# Altium schematic sheet PCB.schdoc
size 420 x 297 mm; Color: #000000; Width: 1655; Height: 1170; Symbol: Drawing-Symbol_A4; Company: 嘉立创EDA; Version: V1.0; Page Size: A4; @Project Name: Watcher; @Update Date: 2026-01-27; @Create Date: 2026-01-27; Device: Drawing-Symbol_A4; @Board Name: Board1; @Page Name: P1; @Create Time: 14:43:38; @Page Count: 1; @Page No: 1; @Schematic Name: Schematic1; @Update Time: 14:43:38; @Assembly Variant: Basic; Border: 1; Title Block Position: 3; Size: A4; Region Start: 1; X Region Count: 6; Y Region Count: 4; Blade Width: 10; Title Block: 1
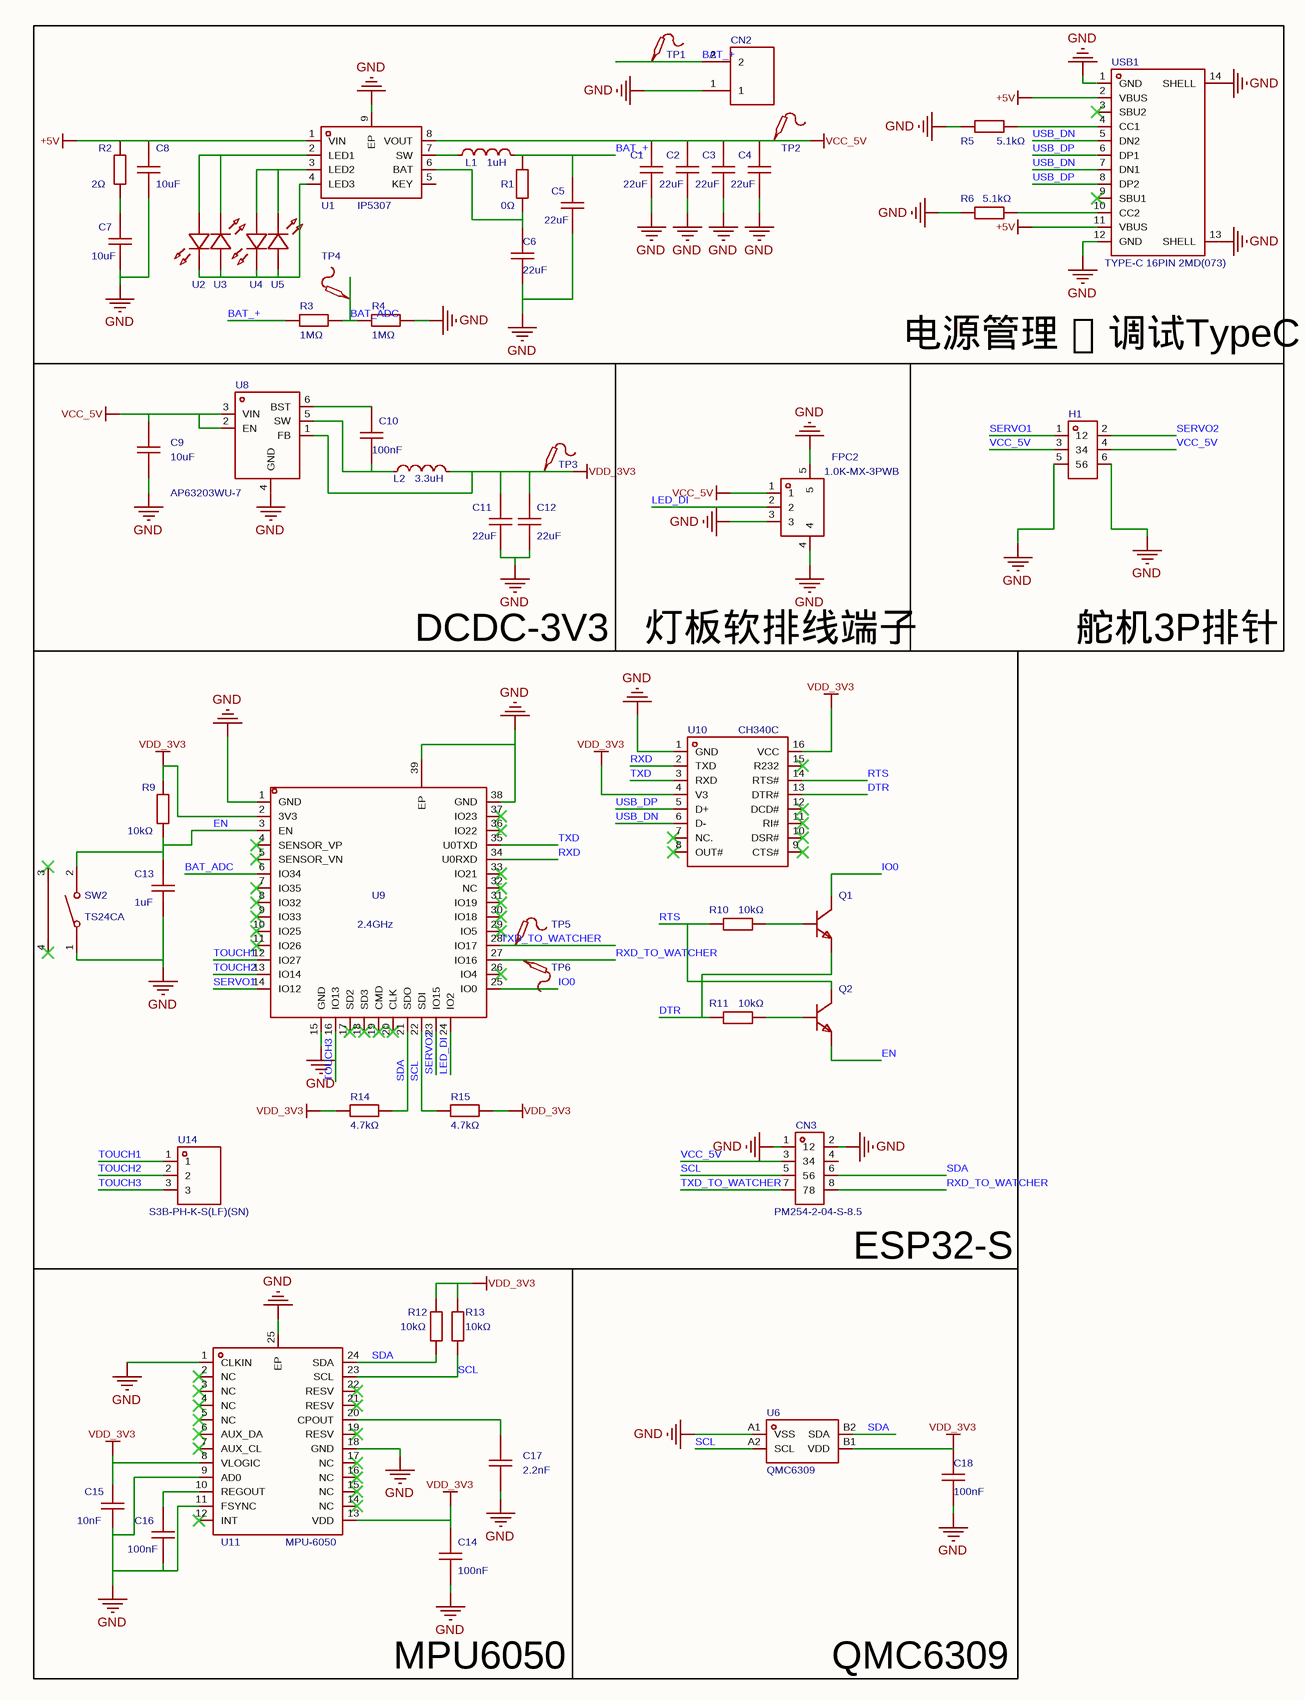
[diagram p0: PCB.schdoc]

## Parts
C1  22uF  [C0603_2]
C2  22uF  [C0603_2]
C3  22uF  [C0603_2]
C4  22uF  [C0603_2]
C5  22uF  [C0603_2]
C6  22uF  [C0603_2]
C7  10uF  [C0603_2]
C8  10uF  [C0603_2]
C9  10uF  [C0603_2]
C10  100nF  [C0603_2]
C11  22uF  [C0603_2]
C12  22uF  [C0603_2]
C13  1uF  [C0603_2]
C14  100nF  [C0603_2]
C15  10nF  [C0603_2]
C16  100nF  [C0603_2]
C17  2.2nF  [C0603_2]
C18  100nF  [C0402]
CN2  B2B-PH-K-S(LF)(SN)  [CONN-TH_B2B-PH-K-S]  (value not drawn)
CN3  PM254-2-04-S-8.5  [HDR-SMD_8P-P2.54-V-F-R2-C4-S7.1]
FPC2  1.0K-MX-3PWB  [FPC-SMD_3P-P1.00_HDGC_1.0K-MX-3PWB]
H1  PZ254V-12-6P  [HDR-TH_6P-P2.54-V-M-R2-C3-S2.54]  (value not drawn)
L1  1uH  [IND-SMD_L4.4-W4.2]
L2  3.3uH  [IND-SMD_L4.4-W4.2-A]
Q1  MMS8050-H-TP  [SOT-23-3_L2.9-W1.3-P1.90-LS2.4-BR_1]  (value not drawn)
Q2  MMS8050-H-TP  [SOT-23-3_L2.9-W1.3-P1.90-LS2.4-BR_1]  (value not drawn)
R1  0Ω  [R0603_3]
R2  2Ω  [R0603_3]
R3  1MΩ  [R0603_3]
R4  1MΩ  [R0603_3]
R5  5.1kΩ  [R0603_3]
R6  5.1kΩ  [R0603_3]
R9  10kΩ  [R0603_3]
R10  10kΩ  [R0603_3]
R11  10kΩ  [R0603_3]
R12  10kΩ  [R0603_3]
R13  10kΩ  [R0603_3]
R14  4.7kΩ  [R0603_3]
R15  4.7kΩ  [R0603_3]
SW2  TS24CA  [SW-SMD_2P-TS24CA]
TP1  (no value)  [Test-Point-0.5mm]
TP2  (no value)  [Test-Point-0.5mm]
TP3  (no value)  [Test-Point-0.5mm]
TP4  (no value)  [Test-Point-0.5mm]
TP5  (no value)  [Test-Point-0.5mm]
TP6  (no value)  [Test-Point-0.5mm]
U1  IP5307  [ESOP-8_L4.9-W3.9-P1.27-LS6.0-BL-EP]
U2  XL-1608PGC-06  [LED0603-RD_GREEN]  (value not drawn)
U3  XL-1608PGC-06  [LED0603-RD_GREEN]  (value not drawn)
U4  XL-1608PGC-06  [LED0603-RD_GREEN]  (value not drawn)
U5  XL-1608PGC-06  [LED0603-RD_GREEN]  (value not drawn)
U6  QMC6309  [X1-WLB0808-4_L0.8-W0.8-P0.40-TL]
U8  AP63203WU-7  [TSOT-26_L2.9-W1.6-P0.95-LS2.8-BL_1]
U9  2.4GHz  [WIRELM-SMD_ESP32-S_1]
U10  CH340C  [SOP-16_L10.0-W3.9-P1.27-LS6.0-BL_1]
U11  MPU-6050  [QFN-24_L4.0-W4.0-P0.50-BL-EP2.7_1]
U14  S3B-PH-K-S(LF)(SN)  [CONN-TH_3P-P2.00_S3B-PH-K-S-LF-SN]
USB1  TYPE-C 16PIN 2MD(073)  [USB-C-SMD_TYPE-C-6PIN-2MD-073]

## Blocks framed on the sheet
电源管理  调试TypeC: C1-C8 CN2 L1 R1-R6 TP1 TP2 TP4 U1-U5 USB1
DCDC-3V3: C9-C12 L2 TP3 U8
舵机3P排针: H1
MPU6050: C14-C17 R12 R13 U11

## Nets
+5V: C8.2 R2.2 U1.1(VIN) USB1.2(VBUS) USB1.11(VBUS)
GND: C1.1 C2.1 C3.1 C4.1 C5.1 C6.1 C7.1 C8.1 C9.1 C11.1 C12.1 C13.1 C14.1 C15.1 C16.1 C17.1 C18.1 CN2.1 CN3.1 CN3.2 FPC2.3 FPC2.4 FPC2.5 H1.5 H1.6 R4.1 R5.1 R6.1 SW2.1 U1.9(EP) U6.A1(VSS) U8.4(GND) U9.1(GND) U9.15(GND) U9.38(GND) U9.39(EP) U10.1(GND) U11.1(CLKIN) U11.9(AD0) U11.11(FSYNC) U11.18(GND) U11.25(EP) USB1.1(GND) USB1.12(GND) USB1.13(SHELL) USB1.14(SHELL)
VCC_5V: C1.2 C2.2 C3.2 C4.2 C9.2 CN3.3 FPC2.1 H1.3 H1.4 TP2.1 U1.8(VOUT) U8.2(EN) U8.3(VIN)
VDD_3V3: C11.2 C12.2 C14.2 C15.2 C18.2 L2.2 R9.2 R12.2 R13.2 R14.1 R15.2 TP3.1 U6.B1(VDD) U8.1(FB) U9.2(3V3) U10.4(V3) U10.16(VCC) U11.8(VLOGIC) U11.13(VDD)
BAT_+: C5.2 CN2.2 L1.2 R1.2 R3.2 TP1.1
BAT_ADC: R3.1 R4.2 TP4.1 U9.6(IO34)
DTR: Q1.2(E) R11.1 U10.13(DTR#)
EN: C13.2 Q2.2(E) R9.1 SW2.2 U9.3(EN)
IO0: Q1.3(C) U9.25(IO0)
LED_DI: FPC2.2 U9.24(IO2)
RTS: Q2.3(C) R10.1 U10.14(RTS#)
RXD: U9.34(U0RXD) U10.2(TXD)
RXD_TO_WATCHER: CN3.8 TP6.1 U9.27(IO16)
SCL: CN3.5 R13.1 R15.1 U6.A2(SCL) U9.22(SDI) U11.23(SCL)
SDA: CN3.6 R12.1 R14.2 U6.B2(SDA) U9.21(SDO) U11.24(SDA)
SERVO1: H1.1 U9.14(IO12)
SERVO2: H1.2 U9.23(IO15)
TOUCH1: U9.12(IO27) U14.1
TOUCH2: U9.13(IO14) U14.2
TOUCH3: U9.16(IO13) U14.3
TXD: U9.35(U0TXD) U10.3(RXD)
TXD_TO_WATCHER: CN3.7 TP5.1 U9.28(IO17)
USB_DN: U10.6(D-) USB1.5(DN2) USB1.7(DN1)
USB_DP: U10.5(D+) USB1.6(DP1) USB1.8(DP2)
NetC6_2: C6.2 R1.1 U1.6(BAT)
NetC7_2: C7.2 R2.1
NetC10_1: C10.1 L2.1 U8.5(SW)
NetC10_2: C10.2 U8.6(BST)
NetC16_2: C16.2 U11.10(REGOUT)
NetC17_2: C17.2 U11.20(CPOUT)
NetL1_1: L1.1 U1.7(SW)
NetQ1_1: Q1.1(B) R10.2
NetQ2_1: Q2.1(B) R11.2
NetR5_2: R5.2 USB1.4(CC1)
NetR6_2: R6.2 USB1.10(CC2)
NetU1_2: U1.2(LED1) U2.2(A) U3.1(K)
NetU1_3: U1.3(LED2) U4.2(A) U5.1(K)
NetU1_4: U1.4(LED3) U2.1(K) U3.2(A) U4.1(K) U5.2(A)

Not connected (* = marked no-connect by the designer): CN3 4; SW2 3* 4*; U1 5(KEY); U9 4(SENSOR_VP)* 5(SENSOR_VN)* 7(IO35)* 8(IO32)* 9(IO33)* 10(IO25)* 11(IO26)* 17(SD2)* 18(SD3)* 19(CMD)* 20(CLK)* 26(IO4)* 29(IO5)* 30(IO18)* 31(IO19)* 32(NC)* 33(IO21)* 36(IO22)* 37(IO23)*; U10 7(NC.)* 8(OUT#)* 9(CTS#)* 10(DSR#)* 11(RI#)* 12(DCD#)* 15(R232)*; U11 2(NC)* 3(NC)* 4(NC)* 5(NC)* 6(AUX_DA)* 7(AUX_CL)* 12(INT)* 14(NC)* 15(NC)* 16(NC)* 17(NC)* 19(RESV)* 21(RESV)* 22(RESV)*; USB1 3(SBU2)* 9(SBU1)*

## Notes on the sheet
- 灯板软排线端子
- (near CN3) ESP32-S
- QMC6309
- 1
- 2
- 3
- 4
- 5
- 6
- A
- B
- C
- 创建日期
- 2026-01-27
- D
- 原理图
- 板子
- Schematic1
- Board1
- 更新日期
- 图页
- P1
- 绘制
- 审阅
- Watcher
- 版本
- V1.0
- 尺寸
- A4
- 页    1    共    1
- 嘉立创EDA

## Library data of the parts
C1-C6 C11 C12 = CGA0603X5R226M100JT: 容值:22uF;精度:±20%;额定电压:10V;温度系数:X5R;; Manufacturer: HRE(芯声); 3D Model: ac125912035d415993ca9572d50418b1; 3D Model Transform: 62.992,31.496,0,0,0,0,0,0,0; Tolerance: ±20%; Voltage Rating: 10V; Temperature Coefficient: X5R; AddInBom: yes; ModelName: C0603_L1.6-W0.8-H0.8; Symbol: CGA0603X5R226M100JT; Device: CGA0603X5R226M100JT; LCSC Part Name: 22uF ±20% 10V; Supplier Part: C6119863; Manufacturer Part: CGA0603X5R226M100JT; Supplier Footprint: 0603; JLCPCB Part Class: 扩展库; Datasheet: https://item.szlcsc.com/datasheet/CGA0603X5R226M100JT/7062569.html; Supplier: LCSC; Value: 22uF; ConvertToPcb: yes; FootprintName: C0603_2
C7-C9 = CGA0603X5R106K100JT: 容值:10uF;精度:±10%;额定电压:10V;温度系数:X5R;; Manufacturer: HRE(芯声); 3D Model: ac125912035d415993ca9572d50418b1; 3D Model Transform: 62.992,31.496,0,0,0,0,0,0,0; Tolerance: ±10%; Voltage Rating: 10V; Temperature Coefficient: X5R; AddInBom: yes; ModelName: C0603_L1.6-W0.8-H0.8; Symbol: CGA0603X5R106K100JT; Device: CGA0603X5R106K100JT; LCSC Part Name: 10uF ±10% 10V; Supplier Part: C6119842; Manufacturer Part: CGA0603X5R106K100JT; Supplier Footprint: 0603; JLCPCB Part Class: 扩展库; Datasheet: https://item.szlcsc.com/datasheet/CGA0603X5R106K100JT/7062548.html; Supplier: LCSC; Value: 10uF; ConvertToPcb: yes; FootprintName: C0603_2
C10 C14 C16 = CC0603KRX7R9BB104: 容值:100nF;精度:±10%;额定电压:50V;温度系数:X7R;; Manufacturer: YAGEO(国巨); Symbol: CC0603KRX7R9BB104_1; 3D Model: ac125912035d415993ca9572d50418b1; 3D Model Transform: 62.992,31.496,0,0,0,0,0,0,0; Tolerance: ±10%; Voltage Rating: 50V; Temperature Coefficient: X7R; AddInBom: yes; ModelName: C0603_L1.6-W0.8-H0.8; Device: CC0603KRX7R9BB104; LCSC Part Name: 100nF ±10% 50V; Supplier Part: C14663; Manufacturer Part: CC0603KRX7R9BB104; Supplier Footprint: 0603; JLCPCB Part Class: 基础库; Datasheet: https://item.szlcsc.com/datasheet/CC0603KRX7R9BB104/15331.html; Supplier: LCSC; Value: 100nF; Voltage Rated: 50V; ConvertToPcb: yes; FootprintName: C0603_2
C13 = CGA0603X5R105K500JT: 容值:1uF;精度:±10%;额定电压:50V;温度系数:X5R;; Manufacturer: HRE(芯声); 3D Model: ac125912035d415993ca9572d50418b1; 3D Model Transform: 62.992,31.496,0,0,0,0,0,0,0; Tolerance: ±10%; Voltage Rating: 50V; Temperature Coefficient: X5R; AddInBom: yes; ModelName: C0603_L1.6-W0.8-H0.8; Symbol: CGA0603X5R105K500JT; Device: CGA0603X5R105K500JT; LCSC Part Name: 1uF ±10% 50V; Supplier Part: C6119852; Manufacturer Part: CGA0603X5R105K500JT; Supplier Footprint: 0603; JLCPCB Part Class: 扩展库; Datasheet: https://item.szlcsc.com/datasheet/CGA0603X5R105K500JT/7062558.html; Supplier: LCSC; Value: 1uF; ConvertToPcb: yes; FootprintName: C0603_2
C15 = CC0603KRX7R9BB103: 容值:10nF;精度:±10%;额定电压:50V;温度系数:X7R;; Manufacturer: YAGEO(国巨); 3D Model: ac125912035d415993ca9572d50418b1; 3D Model Transform: 62.992,31.496,0,0,0,0,0,0,0; Tolerance: ±10%; Voltage Rating: 50V; Temperature Coefficient: X7R; AddInBom: yes; ModelName: C0603_L1.6-W0.8-H0.8; Symbol: CC0603KRX7R9BB103; Device: CC0603KRX7R9BB103; Supplier: LCSC; Manufacturer Part: CC0603KRX7R9BB103; Value: 10nF; Supplier Part: C100042; JLCPCB Part Class: 扩展库; LCSC Part Name: 10nF ±10% 50V; Supplier Footprint: 0603; Datasheet: https://item.szlcsc.com/datasheet/CC0603KRX7R9BB103/101256.html; Voltage Rated: 50V; ConvertToPcb: yes; FootprintName: C0603_2
C17 = FCC0603B222K500CT: 容值:2.2nF;精度:±10%;额定电压:50V;温度系数:X7R;; Manufacturer: FOJAN(富捷); 3D Model: ac125912035d415993ca9572d50418b1; 3D Model Transform: 62.992,31.496,0,0,0,0,0,0,0; Tolerance: ±10%; Voltage Rating: 50V; Temperature Coefficient: X7R; AddInBom: yes; ModelName: C0603_L1.6-W0.8-H0.8; Symbol: FCC0603B222K500CT; Device: FCC0603B222K500CT; LCSC Part Name: 2.2nF ±10% 50V; Supplier Part: C5137562; Manufacturer Part: FCC0603B222K500CT; Supplier Footprint: 0603; JLCPCB Part Class: Extended Part; Datasheet: https://item.szlcsc.com/datasheet/FCC0603B222K500CT/5747014.html; Supplier: LCSC; Value: 2.2nF; ConvertToPcb: yes; FootprintName: C0603_2
C18 = CL05B104KO5NNNC: 容值:100nF;精度:±10%;额定电压:16V;材质(温度系数):X7R;; Manufacturer: SAMSUNG(三星); Symbol: CapAcitance; 3D Model: 36a51122f27c49738f86b3bfa98863e0; 3D Model Transform: 39.37,19.685,0,0,0,0,0,0,0; Tolerance: ±10%; Voltage Rated: 16V; Temperature Coefficient: X7R; AddInBom: yes; ModelName: C0402_L1.0-W0.5-H0.5; Device: CL05B104KO5NNNC; LCSC Part Name: 100nF ±10% 16V; Supplier Part: C1525; Manufacturer Part: CL05B104KO5NNNC; Supplier Footprint: 0402; JLCPCB Part Class: 基础库; Datasheet: https://atta.szlcsc.com/upload/public/pdf/source/20160218/1457707763339.pdf; Supplier: LCSC; Value: 100nF; ConvertToPcb: yes; FootprintName: C0402
CN2 = B2B-PH-K-S(LF)(SN): 插针结构:1x2P;间距:2mm;安装方式:直插;参考系列:PH;总PIN数:2P;排数:1;每排PIN数:2;行距:-;额定电流:2A;触头材质:黄铜;触头镀层:锡;工作温度:-25℃~+85℃;; Manufacturer: JST; 3D Model: 007589569b7e4f74b269bfb3c7ed3cc50819f05c4eef4c71ace90d822a990e87; 3D Model Transform: 236.25937,181.102,0,180,0,0,0,23.622,-137.795; Pins Structure: 1x2P; Pitch: 2mm; Reference Series: PH; Number of PINs Per Row: 2; Current Rating: 2A; Voltage Rating: 100V; Plastic Material: PA66; Flame Retardant Rating: UL94V-0; Supplementary Features: 打K脚; Z-Height of the Board: 6mm; X-Length of Bottom Edge on Board (Spacing Line): 5.9mm; Y-Width of Bottom Edge on Board: 4.5mm; AddInBom: yes; ModelName: CONN-TH_PH2.00-LI-2P; Symbol: B2B-PH-K-S(LF)(SN); Device: B2B-PH-K-S(LF)(SN); LCSC Part Name: 1x2P 间距:2mm 直插 系列:PH; Supplier Part: C131337; Manufacturer Part: B2B-PH-K-S(LF)(SN); Supplier Footprint: 插件,P=2mm; JLCPCB Part Class: Extended Part; Datasheet: https://item.szlcsc.com/datasheet/B2B-PH-K-S(LF)(SN)/142630.html; Supplier: LCSC; Mounting Type: 直插; Number of Pins: 2P; Number of Rows: 1; Row Spacing: -; Contact Material: 黄铜; Contact Plating: 锡; Operating Temperature: -25℃~+85℃; Color: 白色; ConvertToPcb: yes; FootprintName: CONN-TH_B2B-PH-K-S
CN3 = PM254-2-04-S-8.5: 插孔结构:2x4P;间距:2.54mm;行距:2.54mm;圆孔/方孔:方孔;安装方式:立贴;排数:双排;总孔位数:8P;额定电流:3A;插孔方向:顶部;塑高:8.5mm;触头材质:铜合金;工作温度:-40℃~+105℃;; Manufacturer: HCTL(华灿天禄); AddInBom: yes; ModelId: cc5752a4f7204cf4ba4364301e8361650819f05c4eef4c71ace90d822a990e87; ModelTransform: 399.999,279.527,0,0,0,0,0,0,0; Holes Structure: 2x4P; Pitch: 2.54mm; Circular Hole / Square Hole: 方孔; Number of Positions: 8P; Current Rating: 3A; Holes Direction: 顶部; Symbol: PM254-2-04-S-8.5; Device: PM254-2-04-S-8.5; LCSC Part Name: 2x4P 间距:2.54mm 立贴; SupplierPart: C3975149; ManufacturerPart: PM254-2-04-S-8.5; Supplier Footprint: SMD,P=2.54mm; JLCPCB Part Class: Extended Part; Datasheet: https://item.szlcsc.com/datasheet/PM254-2-04-S-8.5/4543700.html; Supplier: LCSC; ConvertToPcb: yes; FootprintName: HDR-SMD_8P-P2.54-V-F-R2-C4-S7.1; ModelName: HDR-SMD_8P-P2.54-V-F-R2-C4-S7.1; Row Spacing: 2.54mm; Mounting Type: 立贴; Number of Rows: 双排; Insulation Height: 8.5mm; Contact Material: 铜合金; Operating Temperature: -40℃~+105℃
FPC2 = 1.0K-MX-3PWB: 锁定特性:抽屉式;触点类型:下接;触点数量:3P;间距:1mm;安装方式:卧贴;工作温度:-20℃~+85℃;; Manufacturer: HDGC(华德共创); AddInBom: yes; ModelId: 464b3a8418d4489894cbd3e194c6d1d50819f05c4eef4c71ace90d822a990e87; ModelTransform: 360.2355,206.693,0,0,0,0,0,-44.213,0; Locking Feature: 抽屉式; Number of Contacts: 3P; Pitch: 1mm; FFC, FCB Thickness: 0.3mm; Rated Voltage (Max): 50V; Current Rating (Max): 400mA; Symbol: 1.0K-MX-3PWB; Device: 1.0K-MX-3PWB; LCSC Part Name: 抽屉式 下接 P数:3P 间距:1mm; SupplierPart: C2915536; ManufacturerPart: 1.0K-MX-3PWB; Supplier Footprint: SMD,P=1mm,卧贴; JLCPCB Part Class: Extended Part; Datasheet: https://item.szlcsc.com/datasheet/1.0K-MX-3PWB/3209091.html; Supplier: LCSC; ConvertToPcb: yes; FootprintName: FPC-SMD_3P-P1.00_HDGC_1.0K-MX-3PWB; ModelName: FPC-SMD_3P-P1.00_HDGC_1.0K-MX-3PWB; Contact Type: 下接; Mounting Type: 卧贴; Height Above Board: 1mm; Contact Material: 磷青铜; Operating Temperature: -20℃~+85℃
H1 = PZ254V-12-6P: 插针结构:2x3P;间距:2.54mm;行距:2.54mm;圆针/方针:方针;安装类型:直插;排数:双排;总PIN位数:6P;额定电流:-;额定电压:-;配合针长度:6mm;塑高:2.5mm;端接针长度:3mm;触头材质:黄铜;触头镀层:-;工作温度范围:-40℃~+105℃;颜色:黑色;; Manufacturer: XFCN(兴飞); 3D Model: e22692306cbd4b5c8488f4142eed6b9c; 3D Model Transform: 300.3931,200,0,0,0,0,0,0,-118.11; Pin Structure: 2x3P; Pitch: 2.54mm; Circluar Pins/Square Pins: 方针; AddInBom: yes; Symbol: PZ254V-12-6P; Device: PZ254V-12-6P; LCSC Part Name: 间距:2.54mm 2x3P 直插 方针; Supplier Part: C492420; Manufacturer Part: PZ254V-12-6P; Supplier Footprint: 插件,P=2.54mm; JLCPCB Part Class: 扩展库; Datasheet: https://atta.szlcsc.com/upload/public/pdf/source/20200309/C492420_BAECB307B001054C09D200388220EAE6.pdf; Supplier: LCSC; Row Spacing: 2.54mm; Mounting Type: 直插; Number of Rows: 双排; Number of Pins: 6P; Current Rating (Max): -; Voltage Rating (Max): -; Length of Mating Pin: 6mm; Insulation Height: 2.5mm; Length of End Connection Pin: 3mm; Contact Material: 黄铜; Contact Plating: -; Operating Temperature Range: -40℃~+105℃; Color: 黑色; ConvertToPcb: yes; FootprintName: HDR-TH_6P-P2.54-V-M-R2-C3-S2.54; ModelName: HDR-TH_6P-P2.54-V-M-R2-C3-S2.54
L1 = FXL0420-1R0-M: 电感值:1uH;精度:±20%;额定电流:6A;饱和电流(Isat):7A;类型:一体成型电感;; Manufacturer: cjiang(长江微电); 3D Model: e9b3d3f4fa134185b54d517730715f16; 3D Model Transform: 173.228,165.354,0,0,0,0,0,0,0; Tolerance: ±20%; Rated Current: 6A; Saturation Current (Isat): 7A; DC Resistance (DCR): 27mΩ; Type: 一体成型电感; AddInBom: yes; ModelName: IND-SMD_L4.2-W4.4-H2.0; Symbol: FXL0420-1R0-M; Device: FXL0420-1R0-M; LCSC Part Name: 1uH ±20% 7A; Supplier Part: C167203; Manufacturer Part: FXL0420-1R0-M; Supplier Footprint: SMD,4.2x4.4mm; JLCPCB Part Class: 扩展库; Datasheet: https://atta.szlcsc.com/upload/public/pdf/source/20240426/3189EA8206330E2108542F9E34E540E7.pdf; Supplier: LCSC; Value: 1uH; ConvertToPcb: yes; FootprintName: IND-SMD_L4.4-W4.2
L2 = FXL0420-3R3-M: 电感值:3.3uH;精度:±20%;额定电流:3.3A;饱和电流(Isat):4A;类型:一体成型电感;; Manufacturer: cjiang(长江微电); 3D Model: ee48d226f3d94ad8b4065f1f448788f0; 3D Model Transform: 173.228,165.354,0,0,0,0,0,0,0; Tolerance: ±20%; Current Rating: 3.3A; Current - Saturation(Isat): 4A; DC Resistance(DCR): 87mΩ; Type: 一体成型电感; AddInBom: yes; ModelName: IND-SMD_L4.4-W4.2-H1.2_PSPMAA0412; Symbol: FXL0420-3R3-M; Device: FXL0420-3R3-M; LCSC Part Name: 3.3uH ±20% 4A; Supplier Part: C167207; Manufacturer Part: FXL0420-3R3-M; Supplier Footprint: SMD,4.4x4.2mm; JLCPCB Part Class: 扩展库; Datasheet: https://item.szlcsc.com/datasheet/FXL0420-3R3-M/178590.html; Supplier: LCSC; Value: 3.3uH; ConvertToPcb: yes; FootprintName: IND-SMD_L4.4-W4.2-A
Q1 Q2 = MMS8050-H-TP: 晶体管类型:NPN;集电极电流(Ic):500mA;集射极击穿电压(Vceo):25V;耗散功率(Pd):300mW;直流电流增益(hFE):120@50mA,1V;; Manufacturer: MCC(美微科); 3D Model: c62791f0466c4ae2a892c056b845b0ca; 3D Model Transform: 98.425,114.173,0,180,0,0,0.0005,-0.0005,0; type: NPN; Current - Collector(Ic): 500mA; Collector - Emitter Voltage VCEO: 25V; Pd - Power Dissipation: 300mW; Transition frequency(fT): 150MHz; Current - Collector Cutoff: 100nA; Vce Saturation(VCE(sat)): 600mV; Emitter-Base Voltage(Vebo): 5V; AddInBom: yes; ModelName: SOT-23-3P_L2.9-W1.3-H1.0-LS2.4-P0.95; Symbol: MMS8050-H-TP; Device: MMS8050-H-TP; LCSC Part Name: NPN 电流:500mA 电压:25V; Supplier Part: C668971; Manufacturer Part: MMS8050-H-TP; Supplier Footprint: SOT-23; JLCPCB Part Class: 扩展库; Datasheet: https://item.szlcsc.com/datasheet/MMS8050-H-TP/699030.html; Supplier: LCSC; DC Current Gain: 120@50mA,1V; Operating Temperature: -55℃~+150℃@(Tj); ConvertToPcb: yes; FootprintName: SOT-23-3_L2.9-W1.3-P1.90-LS2.4-BR_1
R1 = 0603WAF0000T5E: 电阻类型:厚膜电阻;阻值:0Ω;精度:±1%;功率:100mW;工作电压:75V;温度系数:-;; Manufacturer: UNI-ROYAL(厚声); 3D Model: fc143cca1e79419f9cd78b61e9279f08; 3D Model Transform: 31.8897,63.7794,0,90,0,0,0,0,0; Tolerance: ±1%; Power(Watts): 100mW; Voltage-Supply(Max): 75V; AddInBom: yes; ModelName: R0603; Symbol: 0603WAF0000T5E; Device: 0603WAF0000T5E; LCSC Part Name: 0Ω ±1% 100mW 厚膜电阻; Supplier Part: C21189; Manufacturer Part: 0603WAF0000T5E; Supplier Footprint: 0603; JLCPCB Part Class: 基础库; Datasheet: https://item.szlcsc.com/datasheet/0603WAF0000T5E/21903.html; Supplier: LCSC; Type: 厚膜电阻; Value: 0Ω; Temperature Coefficient: -; Operating Temperature: -55℃~+155℃; ConvertToPcb: yes; FootprintName: R0603_3
R2 = 0603WAF200KT5E: 电阻类型:厚膜电阻;阻值:2Ω;精度:±1%;功率:100mW;工作电压:75V;温度系数:±200ppm/℃;; Manufacturer: UNI-ROYAL(厚声); 3D Model: fc143cca1e79419f9cd78b61e9279f08; 3D Model Transform: 31.8897,63.7794,0,90,0,0,0,0,0; Tolerance: ±1%; Power(Watts): 100mW; Voltage-Supply(Max): 75V; AddInBom: yes; ModelName: R0603; Symbol: 0603WAF200KT5E; Device: 0603WAF200KT5E; LCSC Part Name: 2Ω ±1% 100mW 厚膜电阻; Supplier Part: C22977; Manufacturer Part: 0603WAF200KT5E; Supplier Footprint: 0603; JLCPCB Part Class: 基础库; Datasheet: https://item.szlcsc.com/datasheet/0603WAF200KT5E/23704.html; Supplier: LCSC; Type: 厚膜电阻; Value: 2Ω; Temperature Coefficient: ±200ppm/℃; Operating Temperature: -55℃~+155℃; ConvertToPcb: yes; FootprintName: R0603_3
R3 R4 = 0603WAF1004T5E: 电阻类型:厚膜电阻;阻值:1MΩ;精度:±1%;功率:100mW;最大工作电压:75V;温度系数:±100ppm/℃;; Manufacturer: UNI-ROYAL(厚声); 3D Model: fc143cca1e79419f9cd78b61e9279f08; 3D Model Transform: 31.8897,63.7794,0,90,0,0,0,0,0; Tolerance: ±1%; Power(Watts): 100mW; Overload Voltage (Max): 75V; AddInBom: yes; ModelName: R0603; Symbol: 0603WAF1004T5E; Device: 0603WAF1004T5E; LCSC Part Name: 1MΩ ±1% 100mW 厚膜电阻; Supplier Part: C22935; Manufacturer Part: 0603WAF1004T5E; Supplier Footprint: 0603; JLCPCB Part Class: 基础库; Datasheet: https://atta.szlcsc.com/upload/public/pdf/source/20200306/C422600_1E6D84923E4A46A82E41ADD87F860B5C.pdf; Supplier: LCSC; Type: 厚膜电阻; Value: 1MΩ; Temperature Coefficient: ±100ppm/℃; Operating Temperature Range: -55℃~+155℃; ConvertToPcb: yes; FootprintName: R0603_3
R5 R6 = 0603WAF5101T5E_1: 电阻类型:厚膜电阻;阻值:5.1kΩ;精度:±1%;功率:100mW;工作电压:75V;温度系数:±100ppm/℃;; Manufacturer: UNI-ROYAL(厚声); 3D Model: fc143cca1e79419f9cd78b61e9279f08; 3D Model Transform: 31.8897,63.7794,0,90,0,0,0,0,0; Tolerance: ±1%; Power(Watts): 100mW; Voltage-Supply(Max): 75V; AddInBom: yes; ModelName: R0603; Symbol: 0603WAF5101T5E_1; Device: 0603WAF5101T5E_1; LCSC Part Name: 5.1kΩ ±1% 100mW 厚膜电阻; Supplier Part: C23186; Manufacturer Part: 0603WAF5101T5E; Supplier Footprint: 0603; JLCPCB Part Class: 基础库; Datasheet: https://item.szlcsc.com/datasheet/0603WAF5101T5E/23913.html; Supplier: LCSC; Type: 厚膜电阻; Value: 5.1kΩ; Temperature Coefficient: ±100ppm/℃; Operating Temperature: -55℃~+155℃; ConvertToPcb: yes; FootprintName: R0603_3
R9-R13 = 0603WAF1002T5E: 电阻类型:厚膜电阻;阻值:10kΩ;精度:±1%;功率:100mW;工作电压:75V;温度系数:±100ppm/℃;; Manufacturer: UNI-ROYAL(厚声); 3D Model: fc143cca1e79419f9cd78b61e9279f08; 3D Model Transform: 31.8897,63.7794,0,90,0,0,0,0,0; Tolerance: ±1%; Power(Watts): 100mW; Voltage-Supply(Max): 75V; AddInBom: yes; ModelName: R0603; Symbol: 0603WAF1002T5E; Device: 0603WAF1002T5E; Supplier: LCSC; Manufacturer Part: 0603WAF1002T5E; Supplier Part: C25804; Value: 10kΩ; JLCPCB Part Class: 基础库; LCSC Part Name: 厚膜电阻 10kΩ ±1% 100mW; Supplier Footprint: 0603; Datasheet: https://item.szlcsc.com/datasheet/0603WAF1002T5E/26547.html; Type: 厚膜电阻; Temperature Coefficient: ±100ppm/℃; Operating Temperature: -55℃~+155℃; Overload Voltage (Max): 75V; Operating Temperature Range: -55℃~+155℃; ConvertToPcb: yes; FootprintName: R0603_3
R14 R15 = RC0603FR-074K7L: 电阻类型:厚膜电阻;阻值:4.7kΩ;精度:±1%;功率:100mW;工作电压:75V;温度系数:±100ppm/℃;; Manufacturer: YAGEO(国巨); 3D Model: fc143cca1e79419f9cd78b61e9279f080819f05c4eef4c71ace90d822a990e87; 3D Model Transform: 31.8897,63.7794,0,90,0,0,0,0,0; Tolerance: ±1%; Power(Watts): 100mW; Voltage-Supply(Max): 75V; AddInBom: yes; ModelName: R0603; Symbol: RC0603FR-074K7L; Device: RC0603FR-074K7L; LCSC Part Name: 厚膜电阻 4.7kΩ ±1% 100mW; Supplier Part: C99782; Manufacturer Part: RC0603FR-074K7L; Supplier Footprint: 0603; JLCPCB Part Class: Extended Part; Datasheet: https://item.szlcsc.com/datasheet/RC0603FR-074K7L/100996.html; Supplier: LCSC; Type: 厚膜电阻; Value: 4.7kΩ; Temperature Coefficient: ±100ppm/℃; Operating Temperature: -55℃~+155℃; ConvertToPcb: yes; FootprintName: R0603_3
SW2 = TS24CA_1: 电路结构:单刀单掷;按钮形状:矩形按钮;安装方式:卧贴;开关长度:4.55mm;开关宽度:1.8mm;开关高度:3.5mm;触点电流:50mA;额定电压:12V;带灯:-;工作寿命:-;; Manufacturer: SHOU HAN(首韩); 3D Model: 40fd58424abd4d6abbbb880ec41c542e; 3D Model Transform: 185.039,142.9131,0,0,0,0,0,26.929,-15.748; Circuit: 单刀单掷; Actuator Style: 矩形按钮; Switch Height: 3.5mm; Contact Current: 50mA; Voltage Rating: 12V; AddInBom: yes; Symbol: TS24CA_1; Device: TS24CA_1; LCSC Part Name: 4.55*1.8*3.5mm 卧贴 轻触开关; Supplier Part: C393942; Manufacturer Part: TS24CA; Supplier Footprint: SMD,4.6x1.8mm; JLCPCB Part Class: 扩展库; Datasheet: https://item.szlcsc.com/datasheet/TS24CA/372554.html; Supplier: LCSC; Mounting Type: 卧贴; Length: 4.55mm; Width: 1.8mm; With Lamp: -; Life: -; ConvertToPcb: yes; FootprintName: SW-SMD_2P-TS24CA; ModelName: SW-SMD_2P-TS24CA
TP1-TP6 = Test-Point: Test Point 测试点; AddInBom: yes; Symbol: Test-Point; Device: Test-Point; ConvertToPcb: yes; FootprintName: Test-Point-0.5mm
U1 = IP5307: 3D Model: d3e00daa36c445139c055a3b9efb85d2; 3D Model Transform: 240.157,192.913,0,90,0,0,0,0,0; AddInBom: yes; ModelName: ESOP-8_L4.9-W3.9-H1.6-LS6.0-P1.27; Symbol: IP5307; Device: IP5307; LCSC Part Name: IP5307; Supplier Part: C9900106876; Manufacturer Part: IP5307; Supplier Footprint: ESOP8; JLCPCB Part Class: Extended Part; Supplier: LCSC; ConvertToPcb: yes; FootprintName: ESOP-8_L4.9-W3.9-P1.27-LS6.0-BL-EP
U2-U5 = XL-1608PGC-06: 灯头类型:-;发光颜色:翠绿色;正向压降(Vf):2.6V~3V;功率:-;正向电流:-;波长:515nm~530nm;二极管配置:独立二极管;透镜颜色:绿色透镜;色温:-;发光强度:900mcd;发光角度:120°;载带方式:正贴;工作温度:-;; Manufacturer: XINGLIGHT(成兴光); 3D Model: 7761174b67d9475ab0dbce38062fb2f9; 3D Model Transform: 63.7794,31.496,0,0,0,0,0,0,0; Illumination Color: 翠绿色; Peak Wavelength: 525nm; Diode Configuration: 独立二极管; Lens Color: 绿色透镜; Luminous Intensity: 900mcd; Viewing Angle: 120°; AddInBom: yes; Symbol: XL-1608PGC-06; Device: XL-1608PGC-06; LCSC Part Name: 0603加粉翠绿0.6T贴片式发光二极管; Supplier Part: C7371905; Manufacturer Part: XL-1608PGC-06; Supplier Footprint: 0603; JLCPCB Part Class: 扩展库; Datasheet: https://item.szlcsc.com/datasheet/XL-1608PGC-06/8342977.html; Supplier: LCSC; Lamp Holder Type: -; Voltage - Forward(Vf): 2.6V~3V; Power(Watts): -; Forward Current: -; Wavelength - Dominant: 515nm~530nm; Color Temperature: -; Mounting Style: 正贴; Operating Temperature: -; ConvertToPcb: yes; FootprintName: LED0603-RD_GREEN; ModelName: LED0603-RD_GREEN
U6 = QMC6309: Manufacturer: QST(上海矽睿); 3D Model: cd16603c22a74dcc878551ddb2288d55; 3D Model Transform: 31.496,31.496,0,0,0,0,0.002,0.003,0; AddInBom: yes; Symbol: QMC6309; Device: QMC6309; LCSC Part Name: QMC6309; Supplier Part: C5439871; Manufacturer Part: QMC6309; Supplier Footprint: WLCSP-4(0.8x0.8); Datasheet: https://item.szlcsc.com/datasheet/QMC6309/6319593.html; Supplier: LCSC; ConvertToPcb: yes; FootprintName: X1-WLB0808-4_L0.8-W0.8-P0.40-TL; ModelName: X1-WLB0808-4_L0.8-W0.8-P0.40-TL
U8 = AP63203WU-7_1: 功能类型:降压型;工作电压:3.8V~32V;输出电压:3.3V;输出电流:2A;输出类型:固定;; Manufacturer: DIODES(美台); Function: 降压型; Output Voltage: 3.3V; Output Current: 2A; Frequency - Switching: 1.1MHz; Synchronous Rectifier: 是; Number of Outputs: 1; Topology: 降压式; Quiescent Current: 22uA; Switch tube (built-in/external): 内置; Output Type: 固定; 3D Model: 72111e290d4d478b9e0e0b94fc1a26b1; 3D Model Transform: 114.173,110.236,0,0,0,0,0,0,0; AddInBom: yes; ModelName: TSOT-26_L2.9-W1.6-P0.95-LS2.8-BL; Symbol: AP63203WU-7_1; Device: AP63203WU-7_1; LCSC Part Name: 3.8V至32V输入、2A低静态电流同步降压转换器，增强EMI抑制; Supplier Part: C780769; Manufacturer Part: AP63203WU-7; Supplier Footprint: TSOT-23-6; JLCPCB Part Class: 扩展库; Datasheet: https://item.szlcsc.com/datasheet/AP63203WU-7/832852.html; Supplier: LCSC; Voltage - Supply: 3.8V~32V; Operating Temperature: -40℃~+85℃@(TA); ConvertToPcb: yes; FootprintName: TSOT-26_L2.9-W1.6-P0.95-LS2.8-BL_1
U9 = ESP32-S_1: 核心芯片:ESP32芯片;频率:2.4GHz;天线形式:IPEX接口;发射功率:17dBm;接收灵敏度:-90dBm;; Manufacturer: Ai-Thinker(安信可); 3D Model: 7d9ea531105848efa1d5a13d661eefcc; 3D Model Transform: 708.66,1003.935,0,0,0,0,0,146.575,0; Interface Type: I2C；UART；SPI; Antenna Type: IPEX接口; Output Power: 17dBm; Voltage - Supply: 3.3V; Sensitivity: -90dBm; AddInBom: yes; ModelName: WIRELM-SMD_L25.5-W18.0-H2.8-ESP32-S; Symbol: ESP32-S_1; Device: ESP32-S_1; LCSC Part Name: ESP32-S; Supplier Part: C277944; Manufacturer Part: ESP32-S; Supplier Footprint: SMD; JLCPCB Part Class: 扩展库; Datasheet: https://item.szlcsc.com/datasheet/ESP32-S/265264.html; Supplier: LCSC; Utilized IC / Part: ESP32芯片; Wireless Standard: -; Value: 2.4GHz; Receive  Current: -; Send  Current: -; Operating Temperature: -40℃~+85℃; ConvertToPcb: yes; FootprintName: WIRELM-SMD_ESP32-S_1
U10 = CH340C_1: 应用功能:收发器;USB协议版本:USB 2.0;数据速率:2Mbps;; Manufacturer: WCH(南京沁恒); 3D Model: 3361a6792abf4a8f8fbca4f1924a67ee; 3D Model Transform: 240.39054,393.7,0,90,0,0,0,0,0; Applications Function: 收发器; USB Protocol: USB 2.0; Voltage - Supply: 3.3V；5V; Data Rate: 2Mbps; Current - Supply: 7mA; Supply Current (Iq): 50uA; AddInBom: yes; ModelName: SOP-16_L9.9-W3.9-H1.5-LS6.0-P1.27; Symbol: CH340C_1; Device: CH340C_1; LCSC Part Name: USB转串口芯片; Supplier Part: C84681; Manufacturer Part: CH340C; Supplier Footprint: SOP-16; JLCPCB Part Class: 扩展库; Datasheet: https://item.szlcsc.com/datasheet/CH340C/85852.html; Supplier: LCSC; Operating Temperature: -20℃~+70℃; ConvertToPcb: yes; FootprintName: SOP-16_L10.0-W3.9-P1.27-LS6.0-BL_1
U11 = MPU-6050_1: 传感器类型:加速度计陀螺仪;; Manufacturer: TDK InvenSense(应美盛); Symbol: MPU-6050_C24112_1; 3D Model: 3147e748bde04e038f0f2a42301e4816; 3D Model Transform: 158.267,158.267,0,0,0,0,0,0,0; AddInBom: yes; ModelName: QFN-24_L4.0-W4.0-P0.50-BL-EP2.7; Device: MPU-6050_1; LCSC Part Name: MPU-6050; Supplier Part: C24112; Manufacturer Part: MPU-6050; Supplier Footprint: QFN-24-EP(4x4); JLCPCB Part Class: 扩展库; Datasheet: https://item.szlcsc.com/datasheet/MPU-6050/24852.html; Supplier: LCSC; Sensor Type: 加速度计陀螺仪; Operating Temperature: -40℃~+85℃; ConvertToPcb: yes; FootprintName: QFN-24_L4.0-W4.0-P0.50-BL-EP2.7_1
U14 = S3B-PH-K-S(LF)(SN): 插针结构:1x3P;间距:2mm;安装方式:弯插;参考系列:PH;总PIN数:3P;排数:1;每排PIN数:3;行距:-;额定电流:2A;触头材质:黄铜;触头镀层:锡;工作温度:-25℃~+85℃;; Manufacturer: JST; Symbol: S3B-PH-K-S-(LF)(SN); AddInBom: yes; ModelId: 148e0a2f52ff4fbf91b0cd30aa79d04b0819f05c4eef4c71ace90d822a990e87; ModelTransform: 311.06237,299.212,0,0,0,0,0,-96.457,-137.795; Pins Structure: 1x3P; Pitch: 2mm; Reference Series: PH; Number of PINs Per Row: 3; Current Rating: 2A; Voltage Rating: 100V; Plastic Material: PA66; Flame Retardant Rating: UL94V-0; Supplementary Features: 打K脚; Z-Height of the Board: 4.8mm; X-Length of Bottom Edge on Board (Spacing Line): 7.9mm; Y-Width of Bottom Edge on Board: 7.6mm; Device: S3B-PH-K-S(LF)(SN); LCSC Part Name: 1x3P 间距:2mm 弯插 系列:PH; SupplierPart: C157929; ManufacturerPart: S3B-PH-K-S(LF)(SN); Supplier Footprint: 弯插,P=2mm; JLCPCB Part Class: Extended Part; Datasheet: https://item.szlcsc.com/datasheet/S3B-PH-K-S(LF)(SN)/169277.html; Supplier: LCSC; ConvertToPcb: yes; FootprintName: CONN-TH_3P-P2.00_S3B-PH-K-S-LF-SN; ModelName: CONN-TH_3P-P2.00_S3B-PH-K-S-LF-SN; Mounting Type: 弯插; Number of Pins: 3P; Number of Rows: 1; Row Spacing: -; Contact Material: 黄铜; Contact Plating: 锡; Operating Temperature: -25℃~+85℃; Color: 白色
USB1 = TYPE-C 16PIN 2MD(073): 连接器类型:Type-C;协议标准:-;公母:母;安装方式:卧贴;触点数量:16P;端口数量:1;额定电流 - 电源:3A;工作温度:-25℃~+85℃;; Manufacturer: SHOU HAN(首韩); 3D Model: 3a41b9ec9b654a0fad4d118405ec6290; 3D Model Transform: 351.9678,298.4246,0,0,0,0,0,-47.244,-35.433; Gender: 母; Number of Contacts: 16P; Number of Ports: 1; Current Rating-Power: 3A; Voltage Rating: 5V; Connect-Disconnect Life: 5千次; Detection color: 黑色; AddInBom: yes; Symbol: TYPE-C 16PIN 2MD(073); Device: TYPE-C 16PIN 2MD(073); LCSC Part Name: 16P卧贴母座; Supplier Part: C2765186; Manufacturer Part: TYPE-C 16PIN 2MD(073); Supplier Footprint: SMD; JLCPCB Part Class: 扩展库; Datasheet: https://item.szlcsc.com/datasheet/TYPE-C%252016PIN%25202MD(073)/2901843.html; Supplier: LCSC; Connector Type: Type-C; Protocol Standard: -; Mounting Type: 卧贴; Supplementary Features: -; Center Height: -; Length: -; Operating Temperature: -25℃~+85℃; ConvertToPcb: yes; FootprintName: USB-C-SMD_TYPE-C-6PIN-2MD-073; ModelName: USB-C-SMD_TYPE-C-6PIN-2MD-073